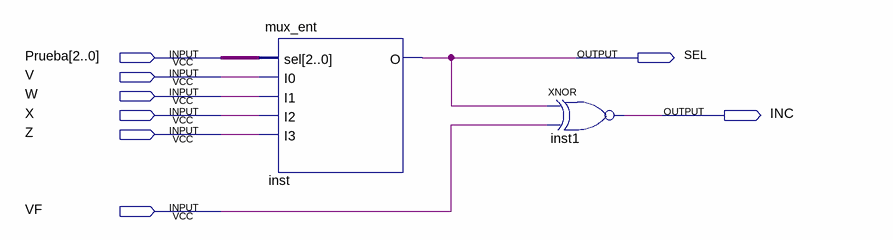
[diagram p0: schematic sheet]
// Quartus schematic logica.bdf as structural Verilog: 2 symbols, 8 pins
module logica (
  input  [2:0] Prueba,
  input  V,
  input  W,
  input  X,
  input  Z,
  input  VF,
  output SEL,
  output INC
);

  mux_ent inst (.sel(Prueba), .I0(V), .I1(W), .I2(X), .I3(Z), .O(SEL));
  xnor inst1 (INC, SEL, VF);
endmodule
